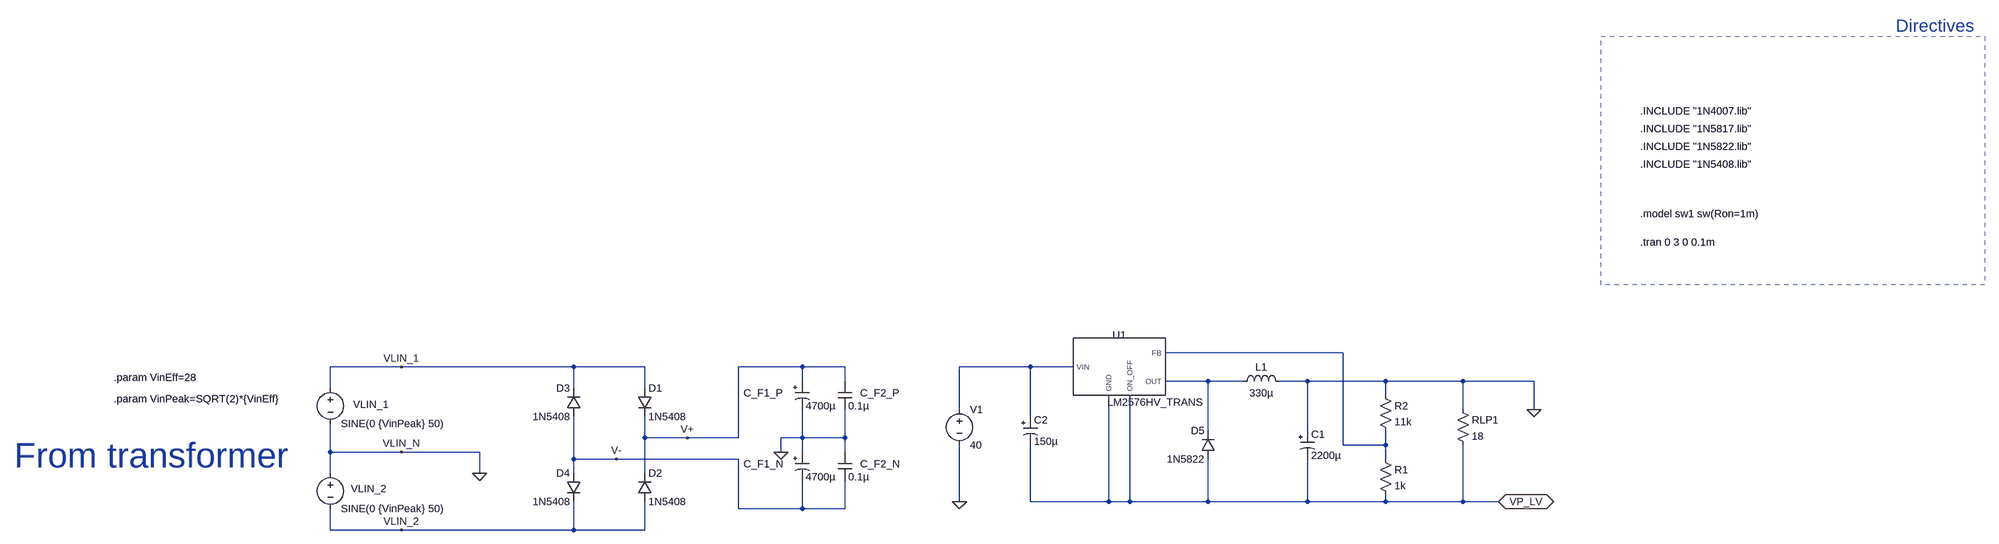
[diagram p0: schematic power_supply_D_V_0.1.asc]
power_supply_D_V_0.1.asc, the LTspice schematic file:
Version 4
SHEET 1 4716 1220
WIRE 2608 -576 2208 -576
WIRE -96 -544 -256 -544
WIRE 752 -544 -96 -544
WIRE 912 -544 752 -544
WIRE 1280 -544 1136 -544
WIRE 1376 -544 1280 -544
WIRE 1904 -544 1744 -544
WIRE 2000 -544 1904 -544
WIRE 1280 -512 1280 -544
WIRE 1376 -512 1376 -544
WIRE 2304 -512 2208 -512
WIRE 2384 -512 2304 -512
WIRE 2528 -512 2464 -512
WIRE 2704 -512 2528 -512
WIRE 3088 -512 2704 -512
WIRE 3248 -512 3088 -512
WIRE -256 -496 -256 -544
WIRE 752 -496 752 -544
WIRE 912 -496 912 -544
WIRE 2704 -480 2704 -512
WIRE 1744 -448 1744 -544
WIRE 3088 -448 3088 -512
WIRE 3248 -448 3248 -512
WIRE 1904 -432 1904 -544
WIRE 2304 -400 2304 -512
WIRE 2528 -400 2528 -512
WIRE 912 -384 912 -432
WIRE 1008 -384 912 -384
WIRE 1136 -384 1136 -544
WIRE 1136 -384 1008 -384
WIRE 1280 -384 1280 -448
WIRE 1280 -384 1232 -384
WIRE 1376 -384 1376 -448
WIRE 1376 -384 1280 -384
WIRE 2608 -368 2608 -576
WIRE 2704 -368 2704 -400
WIRE 2704 -368 2608 -368
WIRE -256 -352 -256 -416
WIRE -96 -352 -256 -352
WIRE 80 -352 -96 -352
WIRE 1232 -352 1232 -384
WIRE 1280 -352 1280 -384
WIRE 1376 -352 1376 -384
WIRE 752 -336 752 -432
WIRE 848 -336 752 -336
WIRE 1136 -336 848 -336
WIRE 2704 -336 2704 -368
WIRE -256 -304 -256 -352
WIRE 80 -304 80 -352
WIRE 752 -304 752 -336
WIRE 912 -304 912 -384
WIRE 1744 -240 1744 -368
WIRE 1904 -240 1904 -368
WIRE 2080 -240 2080 -480
WIRE 2080 -240 1904 -240
WIRE 2128 -240 2128 -480
WIRE 2128 -240 2080 -240
WIRE 2304 -240 2304 -336
WIRE 2304 -240 2128 -240
WIRE 2528 -240 2528 -336
WIRE 2528 -240 2304 -240
WIRE 2704 -240 2704 -256
WIRE 2704 -240 2528 -240
WIRE 3088 -240 3088 -368
WIRE 3088 -240 2704 -240
WIRE 3168 -240 3088 -240
WIRE 1136 -224 1136 -336
WIRE 1280 -224 1280 -288
WIRE 1280 -224 1136 -224
WIRE 1376 -224 1376 -288
WIRE 1376 -224 1280 -224
WIRE -256 -176 -256 -224
WIRE -96 -176 -256 -176
WIRE 752 -176 752 -240
WIRE 752 -176 -96 -176
WIRE 912 -176 912 -240
WIRE 912 -176 752 -176
FLAG -96 -544 VLIN_1
FLAG -96 -176 VLIN_2
FLAG -96 -352 VLIN_N
FLAG 80 -304 0
FLAG 848 -336 V-
FLAG 1008 -384 V+
FLAG 1232 -352 0
FLAG 3168 -240 VP_LV
IOPIN 3168 -240 BiDir
FLAG 1744 -240 0
FLAG 3248 -448 0
DATAFLAG 2752 -512 ""
SYMBOL voltage -256 -512 R0
WINDOW 123 0 0 Left 2
WINDOW 39 0 0 Left 2
WINDOW 0 51 53 Left 2
SYMATTR InstName VLIN_1
SYMATTR Value SINE(0 {VinPeak} 50)
SYMBOL diode 896 -496 R0
SYMATTR InstName D1
SYMATTR Value 1N5408
SYMBOL diode 896 -240 M180
WINDOW 0 24 64 Left 2
WINDOW 3 24 0 Left 2
SYMATTR InstName D2
SYMATTR Value 1N5408
SYMBOL polcap 1264 -512 R0
WINDOW 0 -116 27 Left 2
WINDOW 3 24 56 Left 2
SYMATTR InstName C_F1_P
SYMATTR Value 4700µ
SYMATTR Description Capacitor
SYMATTR Type cap
SYMATTR SpiceLine V=35 Irms=1.45 Rser=0.044 Lser=0 mfg="Nichicon" pn="UPR1V222MRH" type="Al electrolytic"
SYMBOL cap 1360 -512 R0
WINDOW 0 50 27 Left 2
SYMATTR InstName C_F2_P
SYMATTR Value 0.1µ
SYMATTR SpiceLine V=4 Irms=1.62 Rser=0.0464862 Lser=0 mfg="KEMET" pn="C0402C104K7PAC" type="X5R"
SYMBOL diode 768 -432 R180
WINDOW 0 24 64 Left 2
WINDOW 3 24 0 Left 2
SYMATTR InstName D3
SYMATTR Value 1N5408
SYMBOL diode 768 -304 M0
SYMATTR InstName D4
SYMATTR Value 1N5408
SYMBOL voltage -256 -320 R0
WINDOW 123 0 0 Left 2
WINDOW 39 0 0 Left 2
WINDOW 0 46 51 Left 2
SYMATTR InstName VLIN_2
SYMATTR Value SINE(0 {VinPeak} 50)
SYMBOL polcap 1264 -352 R0
WINDOW 0 -116 27 Left 2
WINDOW 3 24 56 Left 2
SYMATTR InstName C_F1_N
SYMATTR Value 4700µ
SYMATTR Description Capacitor
SYMATTR Type cap
SYMATTR SpiceLine V=35 Irms=1.45 Rser=0.044 Lser=0 mfg="Nichicon" pn="UPR1V222MRH" type="Al electrolytic"
SYMBOL cap 1360 -352 R0
WINDOW 0 50 27 Left 2
SYMATTR InstName C_F2_N
SYMATTR Value 0.1µ
SYMATTR SpiceLine V=4 Irms=1.62 Rser=0.0464862 Lser=0 mfg="KEMET" pn="C0402C104K7PAC" type="X5R"
SYMBOL res 3072 -464 R0
SYMATTR InstName RLP1
SYMATTR Value 18
SYMBOL diode 2320 -336 R180
WINDOW 0 24 64 Left 2
WINDOW 3 24 0 Left 2
SYMATTR InstName D5
SYMATTR Value 1N5822
SYMBOL ind 2368 -496 R270
WINDOW 0 32 56 VTop 2
WINDOW 3 5 56 VBottom 2
SYMATTR InstName L1
SYMATTR Value 330µ
SYMBOL polcap 2512 -400 R0
SYMATTR InstName C1
SYMATTR Value 2200µ
SYMBOL res 2688 -352 R0
SYMATTR InstName R1
SYMATTR Value 1k
SYMBOL res 2688 -496 R0
SYMATTR InstName R2
SYMATTR Value 11k
SYMBOL LM2576HV_TRANS 2096 -544 R0
SYMATTR InstName U1
SYMBOL voltage 1744 -464 R0
SYMATTR InstName V1
SYMATTR Value 40
SYMBOL polcap 1888 -432 R0
SYMATTR InstName C2
SYMATTR Value 150µ
TEXT -968 -344 Left 6 ;From transformer
TEXT 3912 -1232 Left 2 !.tran 0 3 0 0.1m
TEXT 3912 -1528 Left 2 !.INCLUDE "1N4007.lib"
TEXT 3912 -1488 Left 2 !.INCLUDE "1N5817.lib"
TEXT 3912 -1448 Left 2 !.INCLUDE "1N5822.lib"
TEXT 3912 -1296 Left 2 !.model sw1 sw(Ron=1m)
TEXT 4488 -1720 Left 4 ;Directives
TEXT 3912 -1408 Left 2 !.INCLUDE "1N5408.lib"
TEXT -744 -520 Left 2 !.param VinEff=28
TEXT -744 -472 Left 2 !.param VinPeak=SQRT(2)*{VinEff}
RECTANGLE Normal 4688 -1136 3824 -1696 3

The netlist it stands for:
* power_supply_D_V_0.1.asc
VLIN_1 VLIN_1 0 SINE(0 {VinPeak} 50)
D1 VLIN_1 V+ 1N5408
D2 VLIN_2 V+ 1N5408
C_F1_P V+ 0 4700µ V=35 Irms=1.45 Rser=0.044 Lser=0 mfg="Nichicon" pn="UPR1V222MRH" type="Al electrolytic"
C_F2_P V+ 0 0.1µ V=4 Irms=1.62 Rser=0.0464862 Lser=0 mfg="KEMET" pn="C0402C104K7PAC" type="X5R"
D3 V- VLIN_1 1N5408
D4 V- VLIN_2 1N5408
VLIN_2 0 VLIN_2 SINE(0 {VinPeak} 50)
C_F1_N 0 V- 4700µ V=35 Irms=1.45 Rser=0.044 Lser=0 mfg="Nichicon" pn="UPR1V222MRH" type="Al electrolytic"
C_F2_N 0 V- 0.1µ V=4 Irms=1.62 Rser=0.0464862 Lser=0 mfg="KEMET" pn="C0402C104K7PAC" type="X5R"
RLP1 0 VP_LV 18
D5 VP_LV N003 1N5822
L1 N003 0 330µ
C1 0 VP_LV 2200µ
R1 N001 VP_LV 1k
R2 0 N001 11k
XU1 N002 N003 VP_LV N001 VP_LV LM2576HV_TRANS  ; pins VIN OUT GND FB ON_OFF
V1 N002 0 40
C2 N002 VP_LV 150µ
.model D D
.lib standard.dio
* From transformer
.tran 0 3 0 0.1m
.INCLUDE "1N4007.lib"
.INCLUDE "1N5817.lib"
.INCLUDE "1N5822.lib"
.model sw1 sw(Ron=1m)
* Directives
.INCLUDE "1N5408.lib"
.param VinEff=28
.param VinPeak=SQRT(2)*{VinEff}
.lib LM2576HV_TRANS.LIB
.backanno
.end